# Altium schematic sheet STM32F4xxR.SchDoc
size 297 x 209 mm
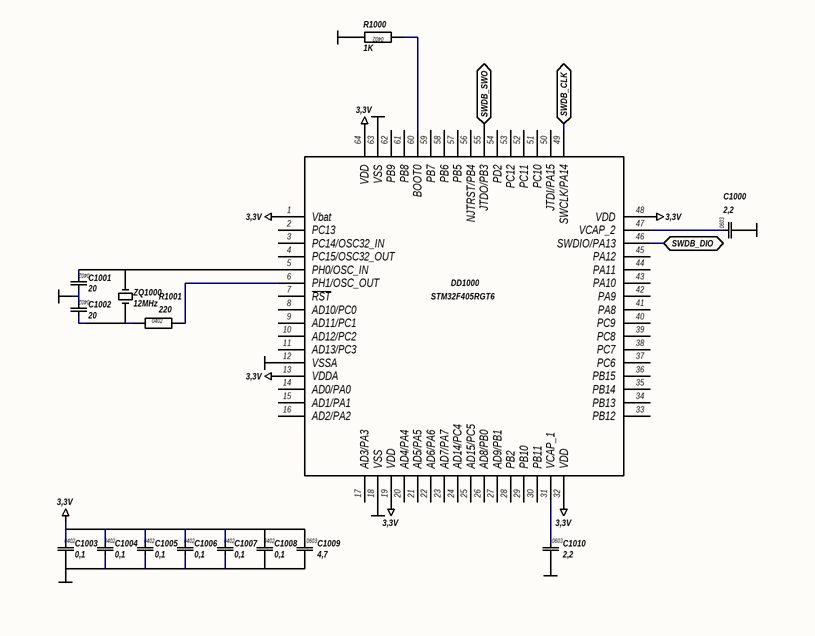
[diagram p0: STM32F4xxR.SchDoc]

## Parts
C1000  2,2  [CAP0603]
C1001  20  [CAP0402]
C1002  20  [CAP0402]
C1003  0,1  [CAP0402]
C1004  0,1  [CAP0402]
C1005  0,1  [CAP0402]
C1006  0,1  [CAP0402]
C1007  0,1  [CAP0402]
C1008  0,1  [CAP0402]
C1009  4,7  [CAP0603]
C1010  2,2  [CAP0603]
DD1000  STM32F405RGT6  [LQFP64]
R1000  1K  [RES0402]
R1001  220  [RES0402]
ZQ1000  12MHz  [KX-7]

## Ports
SWDB_CLK (bidir), SWDB_DIO (bidir), SWDB_SWO (bidir)

## Nets
3,3V: C1003.1 C1004.1 C1005.1 C1006.1 C1007.1 C1008.1 C1009.1 DD1000.1(Vbat) DD1000.13(VDDA) DD1000.19(VDD) DD1000.32(VDD) DD1000.48(VDD) DD1000.64(VDD)
GND: C1000.2 C1001.2 C1002.1 C1003.2 C1004.2 C1005.2 C1006.2 C1007.2 C1008.2 C1009.2 C1010.2 DD1000.12(VSSA) DD1000.18(VSS) DD1000.63(VSS) R1000.2
SWDB_CLK: DD1000.49(SWCLK/PA14) ; port SWDB_CLK
SWDB_DIO: DD1000.46(SWDIO/PA13) ; port SWDB_DIO
SWDB_SWO: DD1000.55(JTDO/PB3) ; port SWDB_SWO
NetC1000_1: C1000.1 DD1000.47(VCAP_2)
NetC1001_1: C1001.1 DD1000.5(PH0/OSC_IN) ZQ1000.1
NetC1002_2: C1002.2 R1001.1 ZQ1000.3
NetC1010_1: C1010.1 DD1000.31(VCAP_1)
NetDD1000_6: DD1000.6(PH1/OSC_OUT) R1001.2
NetDD1000_60: DD1000.60(BOOT0) R1000.1

Not connected (* = marked no-connect by the designer): DD1000 2(PC13) 3(PC14/OSC32_IN) 4(PC15/OSC32_OUT) 7(~{RST}) 8(AD10/PC0) 9(AD11/PC1) 10(AD12/PC2) 11(AD13/PC3) 14(AD0/PA0) 15(AD1/PA1) 16(AD2/PA2) 17(AD3/PA3) 20(AD4/PA4) 21(AD5/PA5) 22(AD6/PA6) 23(AD7/PA7) 24(AD14/PC4) 25(AD15/PC5) 26(AD8/PB0) 27(AD9/PB1) 28(PB2) 29(PB10) 30(PB11) 33(PB12) 34(PB13) 35(PB14) 36(PB15) 37(PC6) 38(PC7) 39(PC8) 40(PC9) 41(PA8) 42(PA9) 43(PA10) 44(PA11) 45(PA12) 50(JTDI/PA15) 51(PC10) 52(PC11) 53(PC12) 54(PD2) 56(NJTRST/PB4) 57(PB5) 58(PB6) 59(PB7) 61(PB8) 62(PB9); ZQ1000 2 4

## Library data of the parts
C1000 C1009 C1010 = CAP_0603: Конденсатор чип; Тип корпуса: 0603; Тип монтажа: Поверхностный; Тип компонента: Конденсатор чип
  C1000 C1010: Номинал: 2,2
  C1009: Номинал: 4,7
C1001 C1002 = CAP_0402: Конденсатор чип; Напряжение: 50V; Тип корпуса: 0402; Тип монтажа: Поверхностный; Номинал: 20; Тип компонента: Конденсатор чип; Value: 20
C1003-C1008 = CAP_0402: Конденсатор чип; Тип корпуса: 0402; Тип монтажа: Поверхностный; Номинал: 0,1; Тип компонента: Конденсатор чип
DD1000 = STM32F4xxR: Микроконтроллер; Производитель: STMicroelectronics; Тип монтажа: Поверхностный; Наименование: STM32F405RGT6; Тип компонента: Микроконтроллер; Тип корпуса: LQFP64
R1000 R1001 = RES_0402: Резистор чип; Тип корпуса: 0402; Тип монтажа: Поверхностный; Характеристики: 0.062Вт 50В; Тип компонента: Резистор чип
  R1000: Номинал: 1K; Value: 1K
  R1001: Номинал: 220; Value: 220
ZQ1000 = KX-7: Кварц; Тип монтажа: Поверхностный; Производитель: Geyer; Номинал: 12MHz; Тип компонента: Кварц; Тип корпуса: KX-7